# Altium schematic sheet DRIVERS.SchDoc
size A2; Organization: Electronic Research & Design; Address1: 11 Granofier; Address2: Zwartkop; Address3: Centurion; Address4: South Africa; Revision: 0
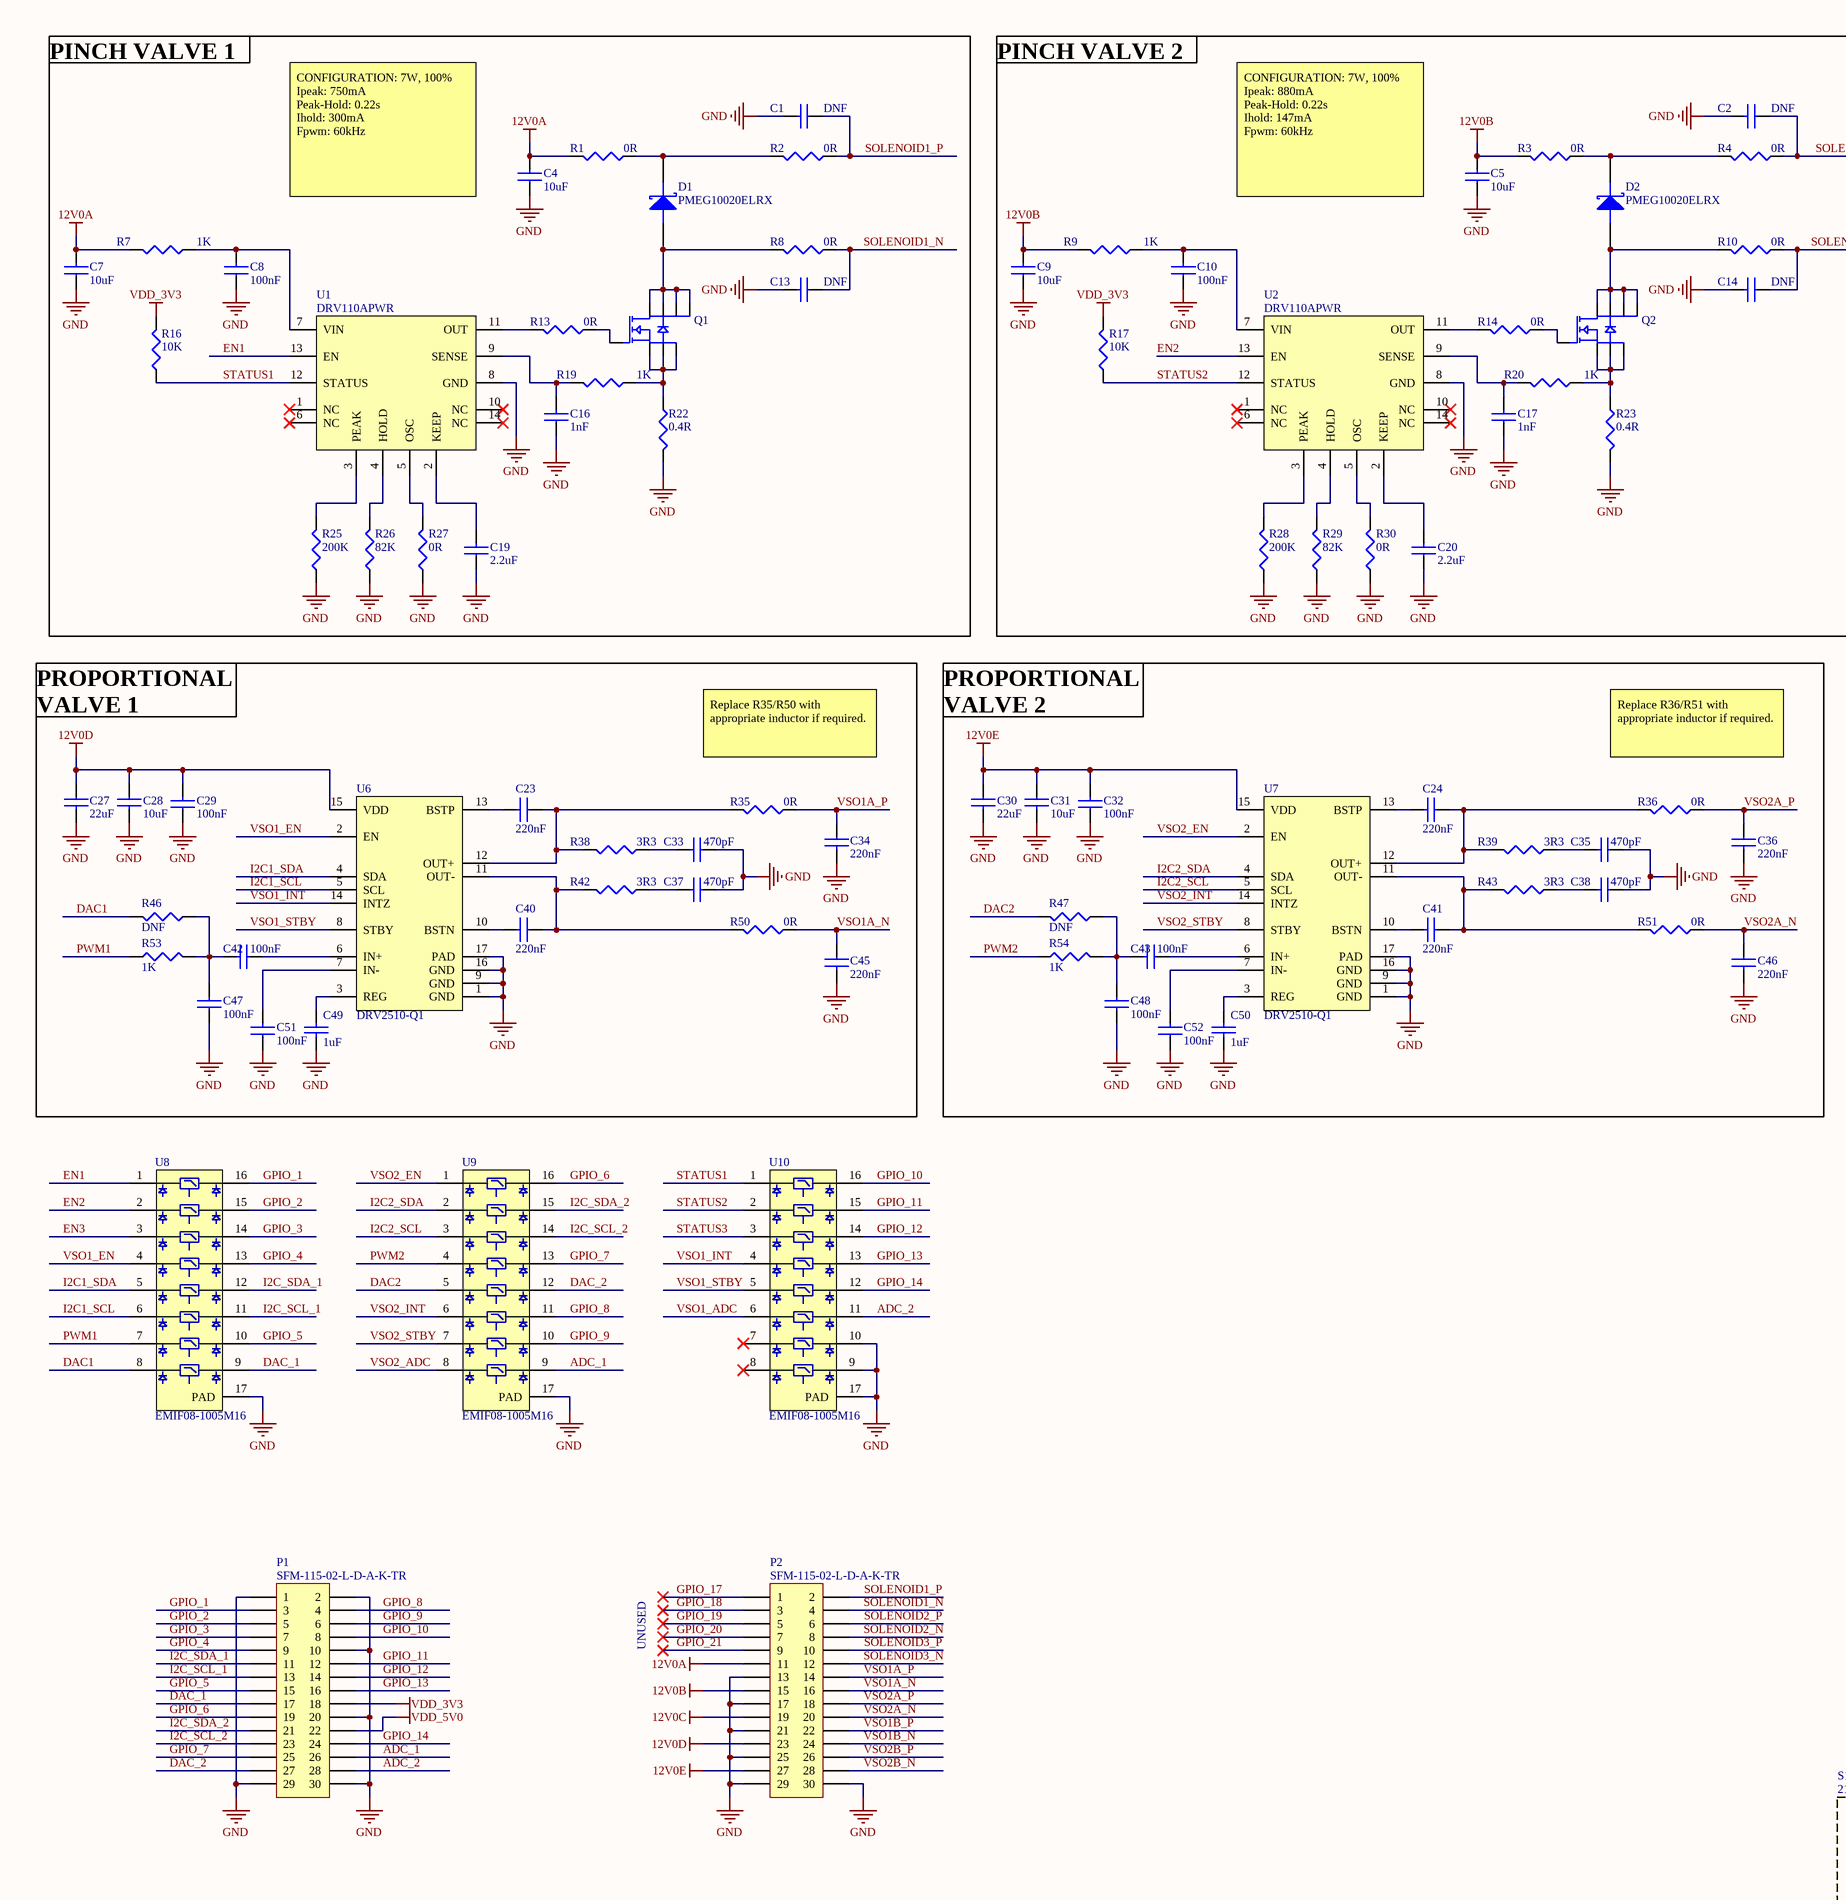
[diagram p0: DRIVERS.SchDoc, left]
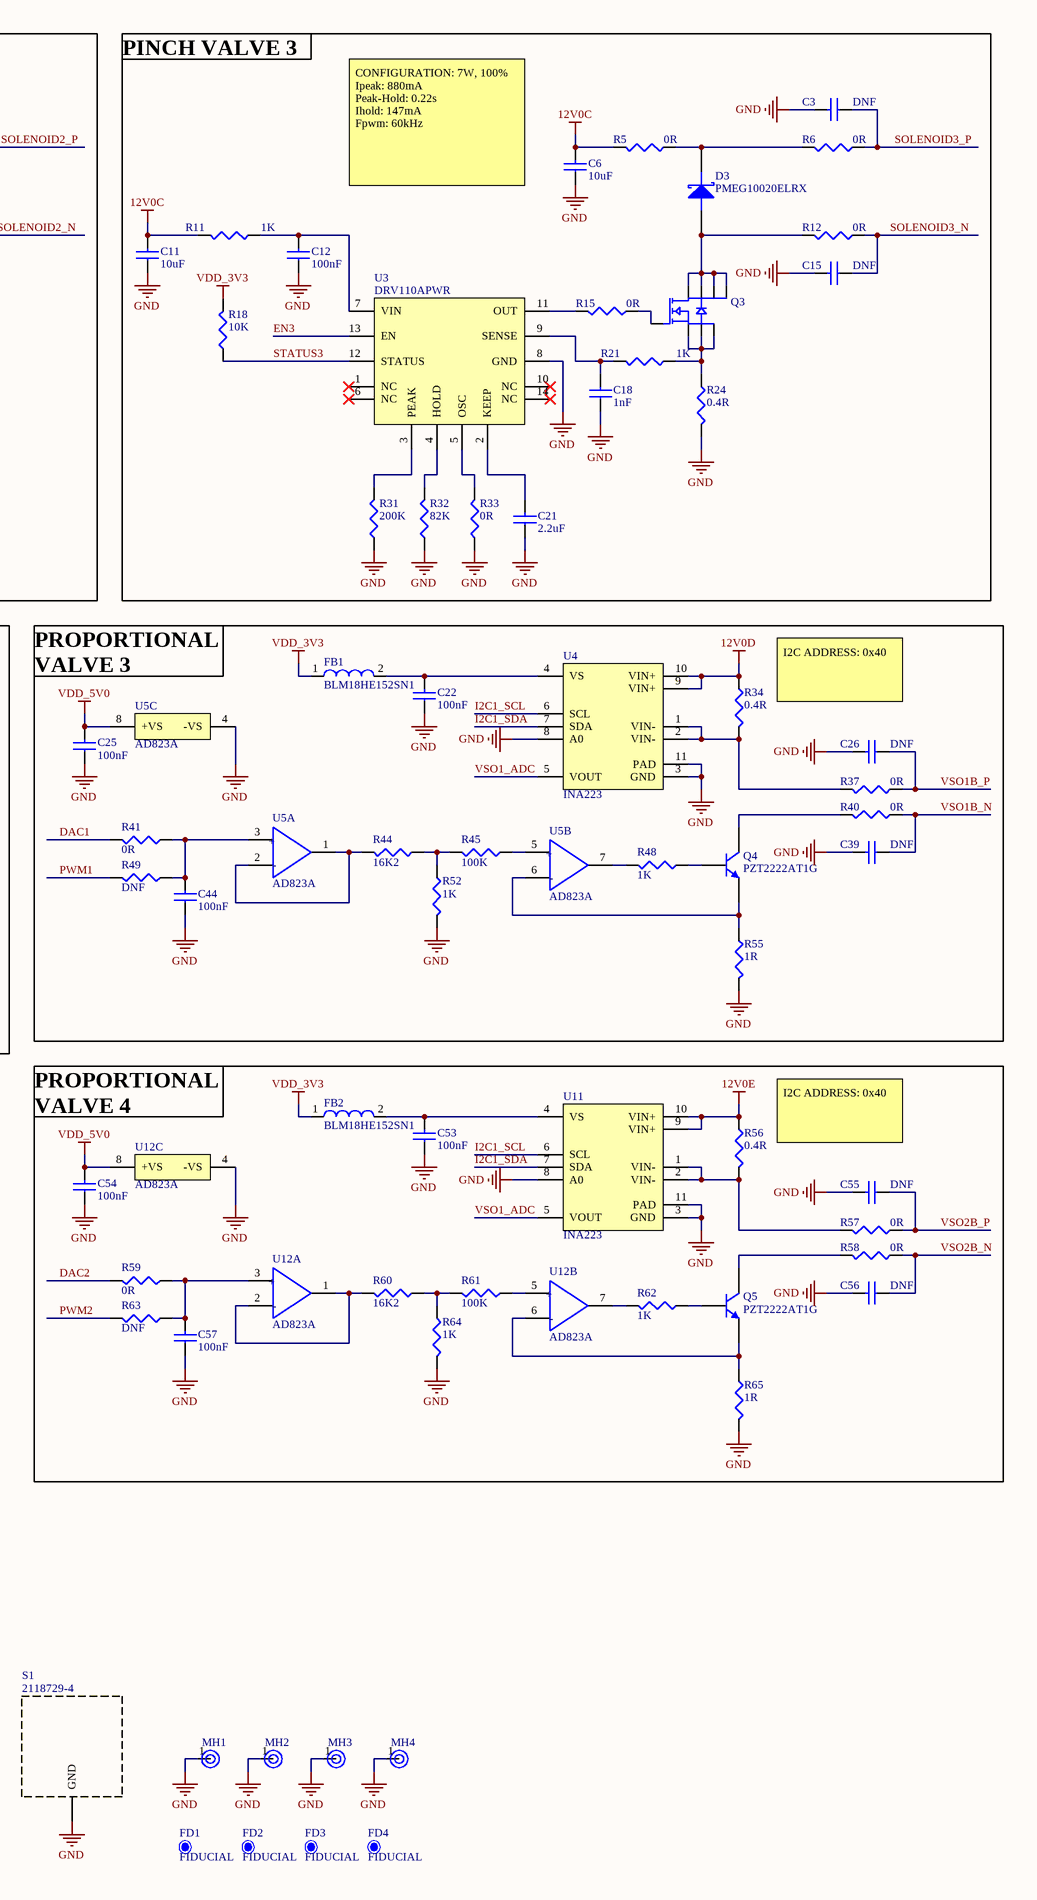
[diagram p1: DRIVERS.SchDoc, right]

## Parts
C1  DNF  [CC0402]
C2  DNF  [CC0402]
C3  DNF  [CC0402]
C4  10uF  [CC0603]
C5  10uF  [CC0603]
C6  10uF  [CC0603]
C7  10uF  [CC0603]
C8  100nF  [CC0402]
C9  10uF  [CC0603]
C10  100nF  [CC0402]
C11  10uF  [CC0603]
C12  100nF  [CC0402]
C13  DNF  [CC0402]
C14  DNF  [CC0402]
C15  DNF  [CC0402]
C16  1nF  [CC0402]
C17  1nF  [CC0402]
C18  1nF  [CC0402]
C19  2.2uF  [CC0603]
C20  2.2uF  [CC0603]
C21  2.2uF  [CC0603]
C22  100nF  [CC0402]
C23  220nF  [CC0603]
C24  220nF  [CC0603]
C25  100nF  [CC0402]
C26  DNF  [CC0402]
C27  22uF  [CC0805]
C28  10uF  [CC0603]
C29  100nF  [CC0402]
C30  22uF  [CC0805]
C31  10uF  [CC0603]
C32  100nF  [CC0402]
C33  470pF  [CC0603]
C34  220nF  [CC0603]
C35  470pF  [CC0603]
C36  220nF  [CC0603]
C37  470pF  [CC0603]
C38  470pF  [CC0603]
C39  DNF  [CC0402]
C40  220nF  [CC0603]
C41  220nF  [CC0603]
C42  100nF  [CC0402]
C43  100nF  [CC0402]
C44  100nF  [CC0402]
C45  220nF  [CC0603]
C46  220nF  [CC0603]
C47  100nF  [CC0402]
C48  100nF  [CC0402]
C49  1uF  [CC0402]
C50  1uF  [CC0402]
C51  100nF  [CC0402]
C52  100nF  [CC0402]
C53  100nF  [CC0402]
C54  100nF  [CC0402]
C55  DNF  [CC0402]
C56  DNF  [CC0402]
C57  100nF  [CC0402]
D1  PMEG10020ELRX  [SOD123W]
D2  PMEG10020ELRX  [SOD123W]
D3  PMEG10020ELRX  [SOD123W]
FB1  BLM18HE152SN1  [LC0603]
FB2  BLM18HE152SN1  [LC0603]
FD1  FIDUCIAL  [FIDUCIAL]
FD2  FIDUCIAL  [FIDUCIAL]
FD3  FIDUCIAL  [FIDUCIAL]
FD4  FIDUCIAL  [FIDUCIAL]
MH1  MH  [MH - M3]  (value not drawn)
MH2  MH  [MH - M3]  (value not drawn)
MH3  MH  [MH - M3]  (value not drawn)
MH4  MH  [MH - M3]  (value not drawn)
P1  SFM-115-02-L-D-A-K-TR  [SFM-115-02-L-D-A-K-TR]
P2  SFM-115-02-L-D-A-K-TR  [SFM-115-02-L-D-A-K-TR]
Q1  BSC054N04NSGATMA1  [PG-TDSON-8 - alternate]  (value not drawn)
Q2  BSC054N04NSGATMA1  [PG-TDSON-8 - alternate]  (value not drawn)
Q3  BSC054N04NSGATMA1  [PG-TDSON-8 - alternate]  (value not drawn)
Q4  PZT2222AT1G  [SOT223]
Q5  PZT2222AT1G  [SOT223]
R1  0R  [RC0603]
R2  0R  [RC0603]
R3  0R  [RC0603]
R4  0R  [RC0603]
R5  0R  [RC0603]
R6  0R  [RC0603]
R7  1K  [RC0402]
R8  0R  [RC0603]
R9  1K  [RC0402]
R10  0R  [RC0603]
R11  1K  [RC0402]
R12  0R  [RC0603]
R13  0R  [RC0402]
R14  0R  [RC0402]
R15  0R  [RC0402]
R16  10K  [RC0402]
R17  10K  [RC0402]
R18  10K  [RC0402]
R19  1K  [RC0402]
R20  1K  [RC0402]
R21  1K  [RC0402]
R22  0.4R  [RC1210]
R23  0.4R  [RC1210]
R24  0.4R  [RC1210]
R25  200K  [RC0402]
R26  82K  [RC0402]
R27  0R  [RC0402]
R28  200K  [RC0402]
R29  82K  [RC0402]
R30  0R  [RC0402]
R31  200K  [RC0402]
R32  82K  [RC0402]
R33  0R  [RC0402]
R34  0.4R  [RC1210]
R35  0R  [RC0603]
R36  0R  [RC0603]
R37  0R  [RC0603]
R38  3R3  [RC0402]
R39  3R3  [RC0402]
R40  0R  [RC0603]
R41  0R  [RC0402]
R42  3R3  [RC0402]
R43  3R3  [RC0402]
R44  16K2  [RC0402]
R45  100K  [RC0402]
R46  DNF  [RC0402]
R47  DNF  [RC0402]
R48  1K  [RC0402]
R49  DNF  [RC0402]
R50  0R  [RC0603]
R51  0R  [RC0603]
R52  1K  [RC0402]
R53  1K  [RC0402]
R54  1K  [RC0402]
R55  1R  [RC0402]
R56  0.4R  [RC1210]
R57  0R  [RC0603]
R58  0R  [RC0603]
R59  0R  [RC0402]
R60  16K2  [RC0402]
R61  100K  [RC0402]
R62  1K  [RC0402]
R63  DNF  [RC0402]
R64  1K  [RC0402]
R65  1R  [RC0402]
S1  2118729-4  [2118727-2]
U1  DRV110APWR  [TSSOP-14]
U2  DRV110APWR  [TSSOP-14]
U3  DRV110APWR  [TSSOP-14]
U4  INA223
U5  AD823A  [SOIC-8]  (parts A,B,C of 3)
U6  DRV2510-Q1  [HTSSOP-16]
U7  DRV2510-Q1  [HTSSOP-16]
U8  EMIF08-1005M16  [QFN-16L]
U9  EMIF08-1005M16  [QFN-16L]
U10  EMIF08-1005M16  [QFN-16L]
U11  INA223
U12  AD823A  [SOIC-8]  (parts A,B,C of 3)

## Nets
12V0A: C4.2 C7.2 P2.11 R1.2 R7.2
12V0B: C5.2 C9.2 P2.15 R3.2 R9.2
12V0C: C6.2 C11.2 P2.19 R5.2 R11.2
12V0D: C27.1 C28.1 C29.2 P2.23 R34.1 U4.9(VIN+) U4.10(VIN+) U6.15(VDD)
12V0E: C30.1 C31.1 C32.2 P2.27 R56.1 U7.15(VDD) U11.9(VIN+) U11.10(VIN+)
GND: C1.2 C2.2 C3.2 C4.1 C5.1 C6.1 C7.1 C8.1 C9.1 C10.1 C11.1 C12.1 C13.2 C14.2 C15.2 C16.1 C17.1 C18.1 C19.1 C20.1 C21.1 C22.1 C25.1 C26.2 C27.2 C28.2 C29.1 C30.2 C31.2 C32.1 C33.1 C34.2 C35.1 C36.2 C37.1 C38.1 C39.2 C44.1 C45.2 C46.2 C47.1 C48.1 C49.1 C50.1 C51.1 C52.1 C53.1 C54.1 C55.2 C56.2 C57.1 MH1.1 MH2.1 MH3.1 MH4.1 P1.1 P1.2 P1.10 P1.20 P1.29 P1.30 P2.13 P2.17 P2.21 P2.25 P2.29 P2.30 R22.2 R23.2 R24.2 R25.1 R26.1 R27.1 R28.1 R29.1 R30.1 R31.1 R32.1 R33.1 R52.2 R55.2 R64.2 R65.2 S1.1(GND) U1.8(GND) U2.8(GND) U3.8(GND) U4.3(GND) U4.8(A0) U4.11(PAD) U5.4(-VS) U6.1(GND) U6.9(GND) U6.16(GND) U6.17(PAD) U7.1(GND) U7.9(GND) U7.16(GND) U7.17(PAD) U8.17(PAD) U9.17(PAD) U10.9 U10.10 U10.17(PAD) U11.3(GND) U11.8(A0) U11.11(PAD) U12.4(-VS)
VDD_3V3: FB1.1 FB2.1 P1.18 R16.2 R17.2 R18.2
VDD_5V0: C25.2 C54.2 P1.22 U5.8(+VS) U12.8(+VS)
ADC_1: P1.26 U9.9
ADC_2: P1.28 U10.11
DAC1: R41.2 R46.2 U8.8
DAC2: R47.2 R59.2 U9.5
DAC_1: P1.17 U8.9
DAC_2: P1.27 U9.12
EN1: U1.13(EN) U8.1
EN2: U2.13(EN) U8.2
EN3: U3.13(EN) U8.3
GPIO_1: P1.3 U8.16
GPIO_2: P1.5 U8.15
GPIO_3: P1.7 U8.14
GPIO_4: P1.9 U8.13
GPIO_5: P1.15 U8.10
GPIO_6: P1.19 U9.16
GPIO_7: P1.25 U9.13
GPIO_8: P1.4 U9.11
GPIO_9: P1.6 U9.10
GPIO_10: P1.8 U10.16
GPIO_11: P1.12 U10.15
GPIO_12: P1.14 U10.14
GPIO_13: P1.16 U10.13
GPIO_14: P1.24 U10.12
GPIO_17: P2.1
GPIO_18: P2.3
GPIO_19: P2.5
GPIO_20: P2.7
GPIO_21: P2.9
I2C1_SCL: U4.6(SCL) U6.5(SCL) U8.6 U11.6(SCL)
I2C1_SDA: U4.7(SDA) U6.4(SDA) U8.5 U11.7(SDA)
I2C2_SCL: U7.5(SCL) U9.3
I2C2_SDA: U7.4(SDA) U9.2
I2C_SCL_1: P1.13 U8.11
I2C_SCL_2: P1.23 U9.14
I2C_SDA_1: P1.11 U8.12
I2C_SDA_2: P1.21 U9.15
PWM1: R49.2 R53.1 U8.7
PWM2: R54.1 R63.2 U9.4
SOLENOID1_N: C13.1 P2.4 R8.1
SOLENOID1_P: C1.1 P2.2 R2.1
SOLENOID2_N: C14.1 P2.8 R10.1
SOLENOID2_P: C2.1 P2.6 R4.1
SOLENOID3_N: C15.1 P2.12 R12.1
SOLENOID3_P: C3.1 P2.10 R6.1
STATUS1: R16.1 U1.12(STATUS) U10.1
STATUS2: R17.1 U2.12(STATUS) U10.2
STATUS3: R18.1 U3.12(STATUS) U10.3
VSO1_ADC: U4.5(VOUT) U10.6 U11.5(VOUT)
VSO1_EN: U6.2(EN) U8.4
VSO1_INT: U6.14(INTZ) U10.4
VSO1_STBY: U6.8(STBY) U10.5
VSO1A_N: C45.1 P2.16 R50.1
VSO1A_P: C34.1 P2.14 R35.1
VSO1B_N: C39.1 P2.24 R40.1
VSO1B_P: C26.1 P2.22 R37.1
VSO2_ADC: U9.8
VSO2_EN: U7.2(EN) U9.1
VSO2_INT: U7.14(INTZ) U9.6
VSO2_STBY: U7.8(STBY) U9.7
VSO2A_N: C46.1 P2.20 R51.1
VSO2A_P: C36.1 P2.18 R36.1
VSO2B_N: C56.1 P2.28 R58.1
VSO2B_P: C55.1 P2.26 R57.1
NetC8_2: C8.2 R7.1 U1.7(VIN)
NetC10_2: C10.2 R9.1 U2.7(VIN)
NetC12_2: C12.2 R11.1 U3.7(VIN)
NetC16_2: C16.2 R19.2 U1.9(SENSE)
NetC17_2: C17.2 R20.2 U2.9(SENSE)
NetC18_2: C18.2 R21.2 U3.9(SENSE)
NetC19_2: C19.2 U1.2(KEEP)
NetC20_2: C20.2 U2.2(KEEP)
NetC21_2: C21.2 U3.2(KEEP)
NetC22_2: C22.2 FB1.2 U4.4(VS)
NetC23_1: C23.1 R35.2 R38.2 U6.12(OUT+)
NetC23_2: C23.2 U6.13(BSTP)
NetC24_1: C24.1 R36.2 R39.2 U7.12(OUT+)
NetC24_2: C24.2 U7.13(BSTP)
NetC33_2: C33.2 R38.1
NetC35_2: C35.2 R39.1
NetC37_2: C37.2 R42.1
NetC38_2: C38.2 R43.1
NetC40_1: C40.1 R42.2 R50.2 U6.11(OUT-)
NetC40_2: C40.2 U6.10(BSTN)
NetC41_1: C41.1 R43.2 R51.2 U7.11(OUT-)
NetC41_2: C41.2 U7.10(BSTN)
NetC42_1: C42.1 U6.6(IN+)
NetC42_2: C42.2 C47.2 R46.1 R53.2
NetC43_1: C43.1 U7.6(IN+)
NetC43_2: C43.2 C48.2 R47.1 R54.2
NetC44_2: C44.2 R41.1 R49.1 U5.3(+IN1)
NetC49_2: C49.2 U6.3(REG)
NetC50_2: C50.2 U7.3(REG)
NetC51_2: C51.2 U6.7(IN-)
NetC52_2: C52.2 U7.7(IN-)
NetC53_2: C53.2 FB2.2 U11.4(VS)
NetC57_2: C57.2 R59.1 R63.1 U12.3(+IN1)
NetD1_1: D1.1 R1.1 R2.2
NetD1_2: D1.2 Q1.5(D) Q1.6(D) Q1.7(D) Q1.8(D) R8.2
NetD2_1: D2.1 R3.1 R4.2
NetD2_2: D2.2 Q2.5(D) Q2.6(D) Q2.7(D) Q2.8(D) R10.2
NetD3_1: D3.1 R5.1 R6.2
NetD3_2: D3.2 Q3.5(D) Q3.6(D) Q3.7(D) Q3.8(D) R12.2
NetQ1_1: Q1.1(S) Q1.2(S) Q1.3(S) R19.1 R22.1
NetQ1_4: Q1.4(G) R13.1
NetQ2_1: Q2.1(S) Q2.2(S) Q2.3(S) R20.1 R23.1
NetQ2_4: Q2.4(G) R14.1
NetQ3_1: Q3.1(S) Q3.2(S) Q3.3(S) R21.1 R24.1
NetQ3_4: Q3.4(G) R15.1
NetQ4_1: Q4.1(C) R40.2
NetQ4_2: Q4.2(B) R48.1
NetQ4_3: Q4.3(E) R55.1 U5.6(-IN2)
NetQ5_1: Q5.1(C) R58.2
NetQ5_2: Q5.2(B) R62.1
NetQ5_3: Q5.3(E) R65.1 U12.6(-IN2)
NetR13_2: R13.2 U1.11(OUT)
NetR14_2: R14.2 U2.11(OUT)
NetR15_2: R15.2 U3.11(OUT)
NetR25_2: R25.2 U1.3(PEAK)
NetR26_2: R26.2 U1.4(HOLD)
NetR27_2: R27.2 U1.5(OSC)
NetR28_2: R28.2 U2.3(PEAK)
NetR29_2: R29.2 U2.4(HOLD)
NetR30_2: R30.2 U2.5(OSC)
NetR31_2: R31.2 U3.3(PEAK)
NetR32_2: R32.2 U3.4(HOLD)
NetR33_2: R33.2 U3.5(OSC)
NetR34_2: R34.2 R37.2 U4.1(VIN-) U4.2(VIN-)
NetR44_1: R44.1 R45.2 R52.1
NetR44_2: R44.2 U5.1(OUT1) U5.2(-IN1)
NetR45_1: R45.1 U5.5(+IN2)
NetR48_2: R48.2 U5.7(OUT2)
NetR56_2: R56.2 R57.2 U11.1(VIN-) U11.2(VIN-)
NetR60_1: R60.1 R61.2 R64.1
NetR60_2: R60.2 U12.1(OUT1) U12.2(-IN1)
NetR61_1: R61.1 U12.5(+IN2)
NetR62_2: R62.2 U12.7(OUT2)

Not connected (* = marked no-connect by the designer): U1 1(NC)* 6(NC)* 10(NC)* 14(NC)*; U2 1(NC)* 6(NC)* 10(NC)* 14(NC)*; U3 1(NC)* 6(NC)* 10(NC)* 14(NC)*; U10 7* 8*

## Notes on the sheet
- PINCH VALVE 1
- PINCH VALVE 2
- PINCH VALVE 3
- CONFIGURATION: 7W, 100%
  Ipeak: 750mA
  Peak-Hold: 0.22s
  Ihold: 300mA
  Fpwm: 60kHz
- CONFIGURATION: 7W, 100%
  Ipeak: 880mA
  Peak-Hold: 0.22s
  Ihold: 147mA
  Fpwm: 60kHz
- PROPORTIONAL VALVE 1
- PROPORTIONAL VALVE 2
- PROPORTIONAL VALVE 3
- I2C ADDRESS: 0x40
- Replace R35/R50 with appropriate inductor if required.
- Replace R36/R51 with appropriate inductor if required.
- PROPORTIONAL VALVE 4
- UNUSED
- Title:
- Project:
- Size:
- Date:
- File:
- A2
- Number:
- Time:
- Revision:
- Sheet
- of
- (in symbol AD823A, part A) +; -
- (in symbol AD823A, part B) +; -

## Library data of the parts
C1-C3 C13-C18 C26 C39 C55 C56 = CAP CER 0.1UF 10V 10% X5R 0402: CAP CER 0.001UF 50V 10% X7R 0402; Manufacturer: Murata; PartNumber: GCM155R71H102KA37D; Package / Case: 0402 (1005 Metric); Supplier: AAD
C4-C7 C9 C11 C28 C31 = CAP CER 0.1UF 10V 10% X5R 0402: CAP CER 10UF 25V 20% X5R 0603; Manufacturer: Murata; PartNumber: GRM188R61E106MA73D; Package / Case: 0603; Supplier: AAD
C8 C10 C12 C22 C25 C29 C32 C42-C44 C47 C48 C51-C54 C57 = CAP CER 0.1UF 10V 10% X5R 0402: CAP CER 0.1UF 50V 10% X7R 0402; Manufacturer: Murata; PartNumber: GCM155R71H104KE02D; Package / Case: 0402 (1005 Metric); Supplier: AAD
C19-C21 = CAP CER 0.1UF 10V 10% X5R 0402: CAP CER 2.2UF 25V 10% X5R 0603; Manufacturer: Murata; PartNumber: GRM188R61E225KA12D; Package / Case: 0603 (1608 Metric)
C23 C24 C34 C36 C40 C41 C45 C46 = CAP CER 0.1UF 10V 10% X5R 0402: CAP CER 0.22UF 25V 10% X7R 0603; Manufacturer: Murata; PartNumber: GRM188R71E224KA88D; Package / Case: 0603
C27 C30 = CAP CER 0.1UF 10V 10% X5R 0402: CAP CER 22UF 25V 20% X5R 0805; Manufacturer: Murata; PartNumber: GRM21BR61E226ME44K; Package / Case: 0805
C33 C35 C37 C38 = CAP CER 0.1UF 10V 10% X5R 0402: CAP CER 470PF 50V 5% C0G/NP0 0402; Manufacturer: Murata; PartNumber: GRM1555C1H471JA01D; Package / Case: 0402
C49 C50 = CAPCERAMIC: CAP CER 1.0UF 10V 10% X5R 0402; PartNumber: GRM153R61A105ME95D
D1-D3 = DIODE SCHOTTKY: DIODE, SCHOTTKY, 100V, 2A, 3.7ns, SOD123W; PartNumber: PMEG10020ELRX
FB1 FB2 = FER_180_200_0: FERRITE, 500mA, 500mOHM, 0603; PartNumber: BLM18HE152SN1
FD1-FD4 = FIDUCIAL: Fiducial 2mm; PartNumber: NA
MH1-MH4 = MountingHole: Mounting Hole; PartNumber: NA
P1 P2 = Header 15X2: Receptacle, 30 POS, 1.27mm PITCH, SMD; PartNumber: SFM-115-02-L-D-A-K-TR
Q1-Q3 = BSC190N15NS3: N-channel FET, 40V, 17A, 5.4mOhm, TDSON-8; pin to pad: 8>8+9; Part Number: BSC054N04NSGATMA1
Q4 Q5 = NPN: NPN BJT, 600 mA, 40V, SOT223; Manufacturer: ON Semiconductor; PartNumber: PZT2222AT1G
R1-R6 R8 R10 R12 R35-R37 R40 R50 R51 R57 R58 = RES_10K_1/16W_1%_0402: RES, 0 OHM, 1/10W, 50mOhm (5%), 0603; Manufacturer: Yageo; PartNumber: RC0603JR-070RP; Package / Case: 0603 (1608 Metric)
R7 R9 R11 R19-R21 R48 R52-R54 R62 R64 = RES_10K_1/16W_1%_0402: RES, 1K OHM, 1/16W, 1%, 0402; Manufacturer: Yageo; PartNumber: RC0402FR-071KL; Package / Case: 0402 (1005 Metric); Supplier: AAD
R13-R15 R27 R30 R33 R41 R46 R47 R49 R59 R63 = RES_10K_1/16W_1%_0402: RES, 0 OHM, 1/16W, 1%, 0402; Manufacturer: Yageo; PartNumber: RC0402FR-070RL; Package / Case: 0402 (1005 Metric); Supplier: AAD
R16-R18 = RES_10K_1/16W_1%_0402: RES, 10K OHM, 1/16W, 1%, 0402; Manufacturer: Yageo; PartNumber: RC0402FR-0710KL; Package / Case: 0402 (1005 Metric); Supplier: AAD
R22-R24 R34 R56 = RES_10K_1/16W_1%_0402: RES, 0.4 OHM, 1/2W, 1%, 2010; Manufacturer: Yageo; PartNumber: WSL2010R4000FEA; Package / Case: 2010
R25 R28 R31 = RES_10K_1/16W_1%_0402: RES, 200K OHM, 1/16W, 1%, 0402; Manufacturer: Yageo; PartNumber: RC0402FR-07200KL; Package / Case: 0402 (1005 Metric); Supplier: AAD
R26 R29 R32 = RES_10K_1/16W_1%_0402: RES, 82K OHM, 1/16W, 1%, 0402; Manufacturer: Yageo; PartNumber: RC0402FR-0782KL; Package / Case: 0402 (1005 Metric); Supplier: AAD
R38 R39 R42 R43 = RES_10K_1/16W_1%_0402: RES, 3.3 OHM, 1/16W, 1%, 0402; Manufacturer: Yageo; PartNumber: RC0402FR-073R3L; Package / Case: 0402 (1005 Metric); Supplier: AAD
R44 R60 = RES_10K_1/16W_1%_0402: RES, 16K2 OHM, 1/16W, 1%, 0402; Manufacturer: Yageo; PartNumber: RC0402FR-0716K2L; Package / Case: 0402 (1005 Metric); Supplier: AAD
R45 R61 = RES_10K_1/16W_1%_0402: RES, 100K OHM, 1/16W, 1%, 0402; Manufacturer: Yageo; PartNumber: RC0402FR-07100KL; Package / Case: 0402 (1005 Metric); Supplier: AAD
R55 R65 = RES_10K_1/16W_1%_0402: RES, 1 OHM, 1/10W, 1%, 0603; Manufacturer: Yageo; PartNumber: RC0603FR-071RL; Package / Case: 0603; Supplier: AAD
S1 = BMI-S-206-F: RF Shield, 31.1mm x 44.6mm x 2mm; PartNumber: 2118729-4
U1-U3 = DRV110: GATE DRIVE, TSSOP-14; PartNumber: DRV110APWR
U4 U11 = INA223: Power Monitor, I2C, SON-10; PartNumber: INA223
U5 U12 = AD823A: Op-AMP, Dual, 17MHz, SOIC-8; PartNumber: AD823A
U6 U7 = DRV2510-Q1: Haptic Driver, 3A, HTSSOP-16; PartNumber: DRV2510-Q1
U8-U10 = EMIF08-1005M16: EMI Filter, ESD, QFN-16L; PartNumber: EMIF08-1005M16